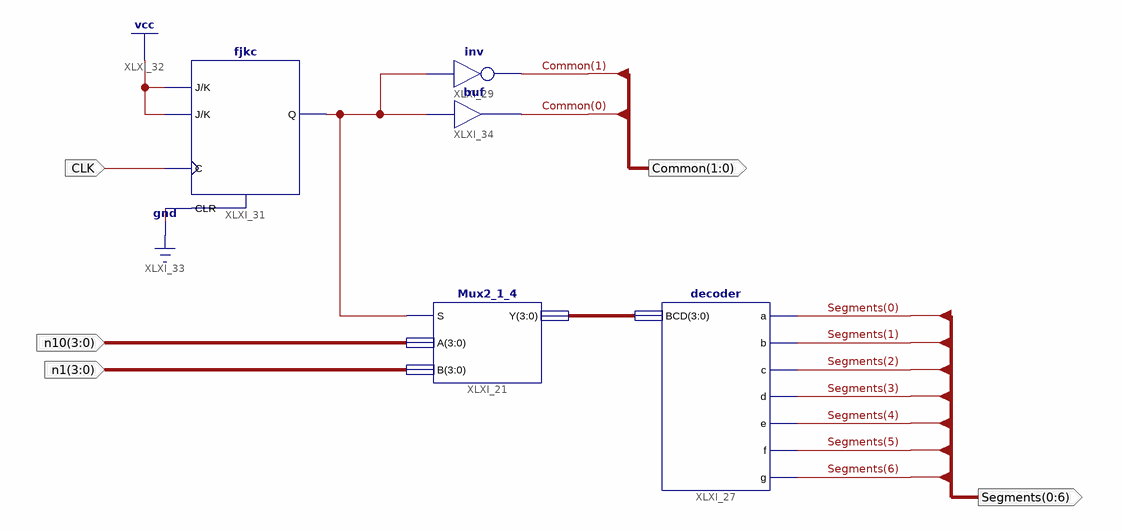
[diagram p0: schematic sheet 1]
// Xilinx ISE schematic Display.sch (spartan6) as structural Verilog: 5 symbols, 5 ports
module Display (
  input  CLK,
  input  [3:0] n10,
  input  [3:0] n1,
  output [0:6] Segments,
  output [1:0] Common
);

  wire XLXN_81;
  wire [3:0] XLXN_58;

  Mux2_1_4 XLXI_21 (.S(XLXN_81), .A(n10), .B(n1), .Y(XLXN_58));
  decoder XLXI_27 (
    .BCD(XLXN_58), .a(Segments[0]), .b(Segments[1]), .c(Segments[2]), .d(Segments[3]), .e(Segments[4]),
    .f(Segments[5]), .g(Segments[6]));
  not XLXI_29 (Common[1], XLXN_81);
  fjkc XLXI_31 (.C(CLK), .CLR(1'b0), .J(1'b1), .K(1'b1), .Q(XLXN_81));
  buf XLXI_34 (Common[0], XLXN_81);
endmodule
